# EAGLE design Decoder (EAGLE 9.6.2)
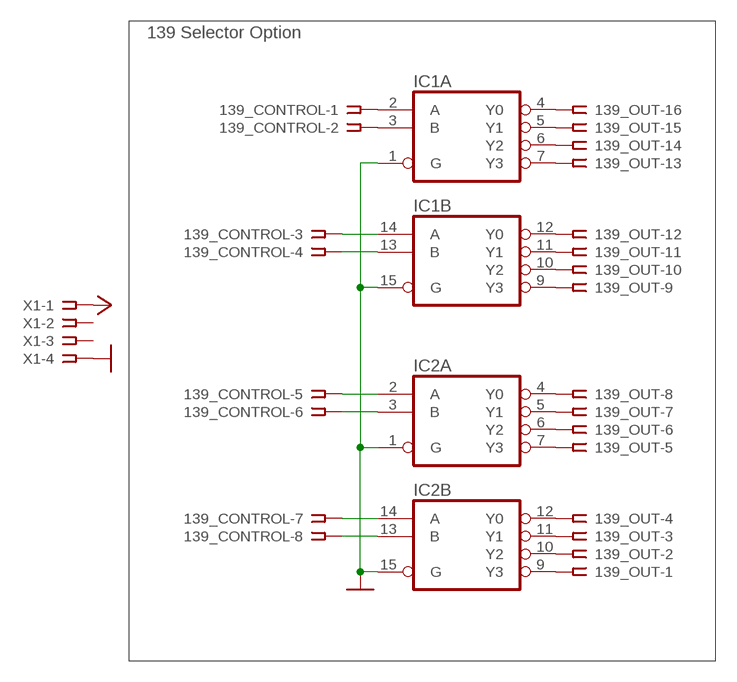
[diagram p0: schematic, sheet 1]

## Parts
139_CONTROL  SSW-108-02-G-S  [SSW-108-02-G-S]
139_OUT  SSW-116-02-G-S  [SSW-116-02-G-S]
IC1  74AC139N  [DIL16]
IC2  74AC139N  [DIL16]
X1  SSW-104-02-G-S  [SSW-104-02-G-S]

## Nets
GND: IC1.1(A:G) IC1.15(B:G) IC2.1(A:G) IC2.15(B:G) X1.4
N$51: 139_OUT.13 IC1.7(A:Y3)
N$52: 139_OUT.14 IC1.6(A:Y2)
N$53: 139_OUT.15 IC1.5(A:Y1)
N$54: 139_OUT.16 IC1.4(A:Y0)
N$55: 139_OUT.9 IC1.9(B:Y3)
N$56: 139_OUT.10 IC1.10(B:Y2)
N$57: 139_OUT.11 IC1.11(B:Y1)
N$58: 139_OUT.12 IC1.12(B:Y0)
N$59: 139_OUT.5 IC2.7(A:Y3)
N$60: 139_OUT.6 IC2.6(A:Y2)
N$61: 139_OUT.7 IC2.5(A:Y1)
N$62: 139_OUT.8 IC2.4(A:Y0)
N$63: 139_OUT.1 IC2.9(B:Y3)
N$64: 139_OUT.2 IC2.10(B:Y2)
N$65: 139_OUT.3 IC2.11(B:Y1)
N$66: 139_OUT.4 IC2.12(B:Y0)
N$67: 139_CONTROL.1 IC1.2(A:A)
N$68: 139_CONTROL.2 IC1.3(A:B)
N$69: 139_CONTROL.8 IC2.13(B:B)
N$70: 139_CONTROL.7 IC2.14(B:A)
N$71: 139_CONTROL.6 IC2.3(A:B)
N$72: 139_CONTROL.5 IC2.2(A:A)
N$73: 139_CONTROL.4 IC1.13(B:B)
N$74: 139_CONTROL.3 IC1.14(B:A)
VCC: X1.1
Unconnected: X1.2 X1.3

## Notes on the sheet
- 139 Selector Option

## Power pins joined to a net without a drawn wire
GND: IC1.8(P:GND) IC2.8(P:GND)
VCC: IC1.16(P:VCC) IC2.16(P:VCC)

## Library data of the parts
139_CONTROL = con-samtec:SSW-108-02-G-S: THROUGH-HOLE .025" SQ POST SOCKET Source: Samtec SSW.pdf; MF: Samtec Inc.; MPN: SSW-108-02-G-S; OC_FARNELL: unknown; OC_NEWARK: 11P9448
139_OUT = con-samtec:SSW-116-02-G-S: THROUGH-HOLE .025" SQ POST SOCKET Source: Samtec SSW.pdf; MF: Samtec Inc.; MPN: SSW-116-02-G-S; OC_FARNELL: unknown; OC_NEWARK: 29C5896
IC1 IC2 = 74xx-eu:74*139: Dual 2-line to 4-line DECODER/DEMULTIPLEXER
X1 = con-samtec:SSW-104-02-G-S: THROUGH-HOLE .025" SQ POST SOCKET Source: Samtec SSW.pdf; MF: Samtec Inc.; MPN: SSW-104-02-G-S; OC_FARNELL: unknown; OC_NEWARK: 11P9384

## Board
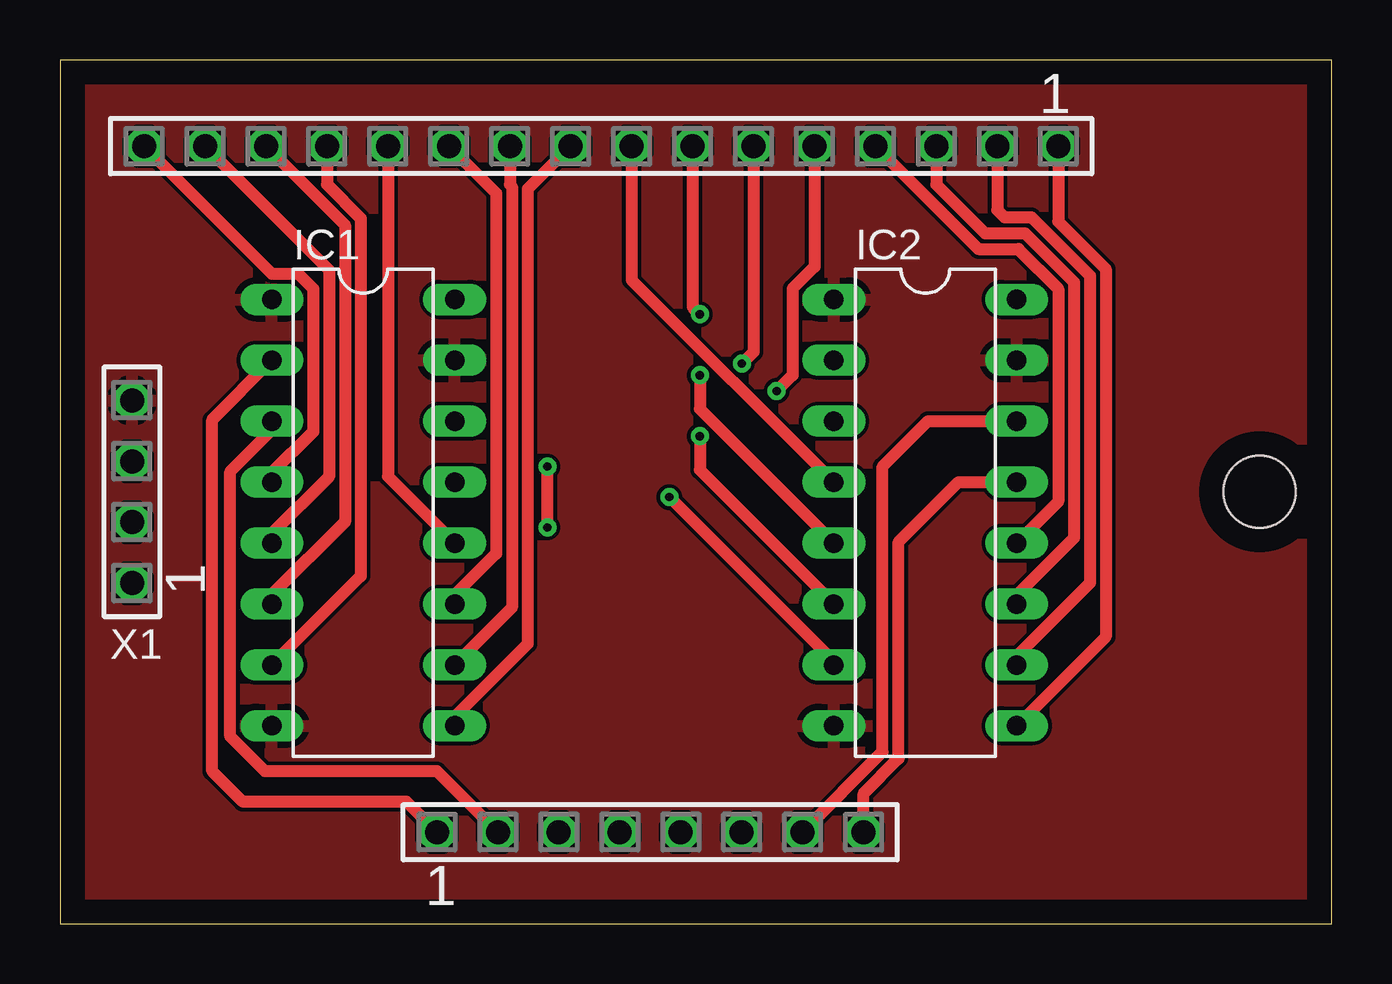
[diagram p1: board, top side]
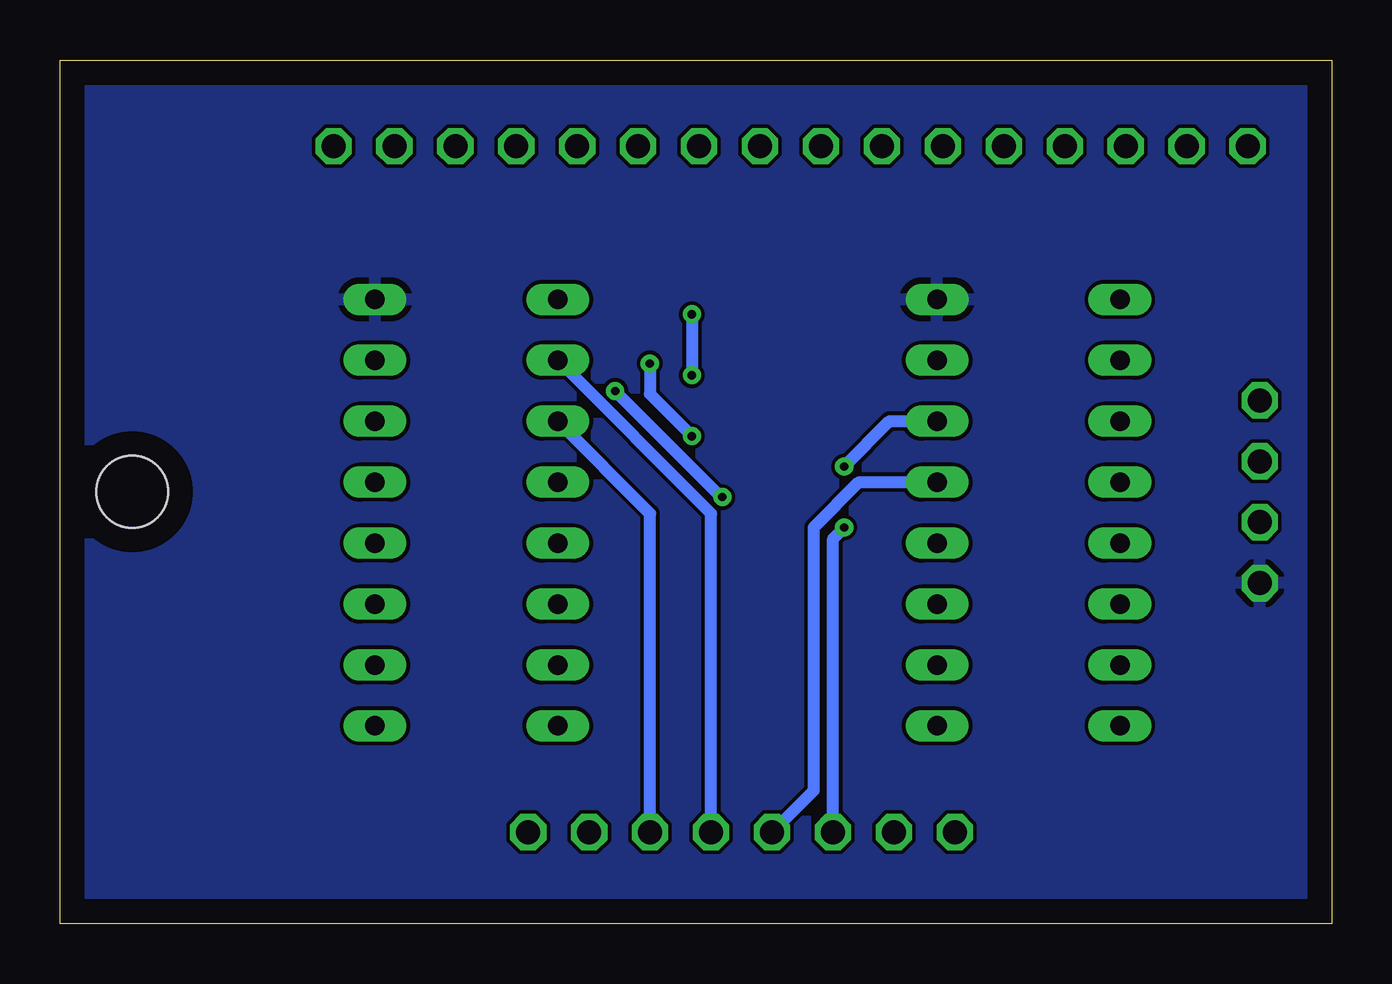
[diagram p2: board, bottom side, seen from below]

Size 53.01 x 36 mm. Coordinates in mm from the lower left corner, seen from the top.
Outline: 0,0 53.01,0 53,36 0,36 0,0
Copper layers (1*16): Top 0.035mm / dielectric 1.5mm / Bottom 0.035mm
Design rules "default": minimum track width 6mil, minimum drill 0.35mm, track to track 6mil, track to pad 6mil, pad to pad 6mil, via to via 6mil, smd to smd 6mil, copper to edge 40mil, drill to drill 6mil, minimum pad ring 10mil, minimum via ring 8mil, stop-mask expansion 4mil, vias tented up to drill 0mil, thermal gap 10mil
Holes 3 mm at 50,18

### Footprints (pad centres in the part's own frame; a part is rotated, then mirrored left to right if it is on the bottom)
SSW-108-02-G-S = drill 1 pad 1.5 octagon: 1 -8.89,0; 2 -6.35,0; 3 -3.81,0; 4 -1.27,0; 5 1.27,0; 6 3.81,0; 7 6.35,0; 8 8.89,0
SSW-116-02-G-S = drill 1 pad 1.5 octagon: 1 -19.05,0; 2 -16.51,0; 3 -13.97,0; 4 -11.43,0; 5 -8.89,0; 6 -6.35,0; 7 -3.81,0; 8 -1.27,0; 9 1.27,0; 10 3.81,0; 11 6.35,0; 12 8.89,0; 13 11.43,0; 14 13.97,0; 15 16.51,0; 16 19.05,0
DIL16 = drill 0.813 long: 1 -8.89,-3.81; 2 -6.35,-3.81; 3 -3.81,-3.81; 4 -1.27,-3.81; 5 1.27,-3.81; 6 3.81,-3.81; 7 6.35,-3.81; 8 8.89,-3.81; 9 8.89,3.81; 10 6.35,3.81; 11 3.81,3.81; 12 1.27,3.81; 13 -1.27,3.81; 14 -3.81,3.81; 15 -6.35,3.81; 16 -8.89,3.81
SSW-104-02-G-S = drill 1 pad 1.5 octagon: 1 -3.81,0; 2 -1.27,0; 3 1.27,0; 4 3.81,0

### Placement (x,y rotation side)
139_CONTROL  24.6,3.81 0 top
139_OUT  22.56,32.41 180 top
IC1  12.64,17.13 270 top
IC2  36.07,17.13 270 top
X1  3,18 90 top

### Tracks (layer width: path | path; a pad name or v marks a point on that pad's centre or on a via)
GND
  pour Top: 0,0 0,36 53,36 53,0
N$51
  Top 0.508: 139_OUT.13 11.13,30.8 12.54,29.4 12.54,14.49 IC1.7
N$52
  Top 0.508: IC1.6 8.83,13.69 11.88,16.74 11.88,29.12 139_OUT.14
N$53
  Top 0.508: IC1.5 8.83,16.23 11.22,18.62 11.22,27.24 139_OUT.15
N$54
  Top 0.508: 139_OUT.16 8.83,27.09 9.93,27.09 10.56,26.46 10.56,20.5 8.83,18.77 IC1.4
N$55
  Top 0.508: 139_OUT.9 19.5,30.62 19.5,11.66 16.45,8.61 IC1.9
N$56
  Top 0.508: 139_OUT.10 18.75,30.8 18.84,30.72 18.84,13.17 IC1.10
N$57
  Top 0.508: IC1.11 16.45,13.69 18.18,15.42 18.18,30.44 139_OUT.11
N$58
  Top 0.508: 139_OUT.12 13.67,18.64 IC1.12
N$59  (via drill 0.35)
  Top 0.508: 139_OUT.5 31.45,27.38 30.53,26.46 30.53,22.86 v29.87,22.2 | v25.4,17.78 32.26,10.92 IC2.7
  Bottom 0.508: v29.87,22.2 25.45,17.78 v25.4,17.78
N$60  (via drill 0.35)
  Top 0.508: 139_OUT.6 28.91,23.83 v28.43,23.34 | v26.67,20.32 26.67,18.91 IC2.6
  Bottom 0.508: v28.43,23.34 28.43,22.07 v26.67,20.32
N$61  (via drill 0.35)
  Top 0.508: 139_OUT.7 26.37,25.7 v26.67,25.4 | v26.67,22.86 26.67,21.45 IC2.5
  Bottom 0.508: v26.67,25.4 v26.67,22.86
N$62
  Top 0.508: 139_OUT.8 23.83,26.83 IC2.4
N$63
  Top 0.508: 139_OUT.1 41.61,29.26 43.59,27.28 43.59,11.95 IC2.9
N$64
  Top 0.508: 139_OUT.2 39.07,29.74 39.37,29.44 40.5,29.44 42.93,27.01 42.93,14.2 39.88,11.15 IC2.10
N$65
  Top 0.508: 139_OUT.3 36.53,30.8 38.55,28.78 40.22,28.78 42.27,26.73 42.27,16.08 39.88,13.69 IC2.11
N$66
  Top 0.508: 139_OUT.4 38.28,28.12 39.95,28.12 41.61,26.46 41.61,17.59 IC2.12
N$67
  Top 0.508: 139_CONTROL.1 14.44,5.08 7.62,5.08 6.35,6.35 6.35,21 IC1.2
N$68
  Top 0.508: 139_CONTROL.2 15.71,6.35 8.55,6.35 7.1,7.8 7.1,18.84 8.83,20.57 IC1.3
N$69
  Top 0.508: 139_CONTROL.8 33.49,5.42 34.95,6.88 34.95,15.9 37.45,18.4 IC2.13
N$70
  Top 0.508: 139_CONTROL.7 34.29,7.15 34.29,19.05 36.18,20.94 IC2.14
N$71
  Bottom 0.508: 139_CONTROL.6 28.41,17.09 IC2.3
N$72
  Bottom 0.508: 139_CONTROL.5 25.87,17.09 IC2.2
N$73
  Bottom 0.508: 139_CONTROL.4 21.59,5.55 21.59,16.51 19.7,18.4 IC1.13
N$74  (via drill 0.35)
  Top 0.508: v20.32,16.51 v20.32,19.05
  Bottom 0.508: 139_CONTROL.3 20.79,16.04 v20.32,16.51 | v20.32,19.05 18.43,20.94 IC1.14
VCC
  pour Bottom: 0,36 53,36 53,0 0,0